# Altium schematic sheet KA1249F51_2.SchDoc
size 297 x 209 mm; Developed: Хажиев А.Ф.; DocumentCode: XXX 1.000.000 Э0; DocumentNumber: XXX 1.000.000 Э3; SheetNumber: 2; SheetTotal: 1
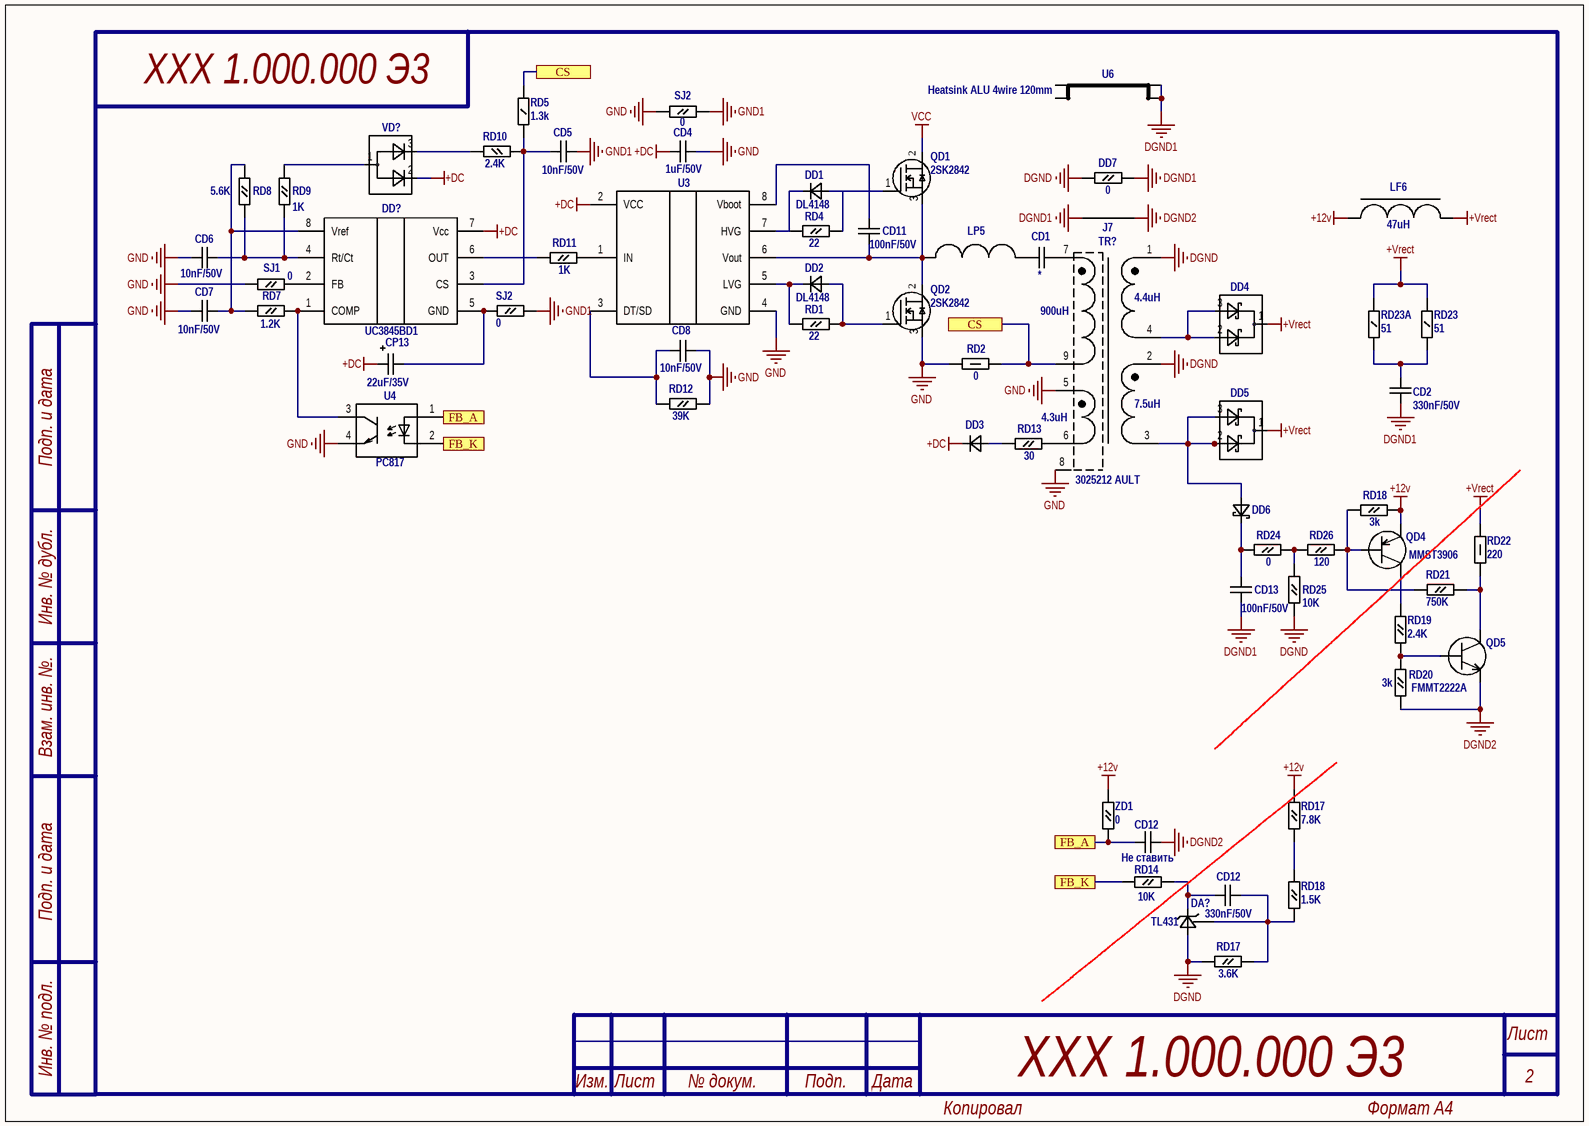
[diagram p0: KA1249F51_2.SchDoc]

## Parts
(Parts that share a designator on the sheet are numbered #1, #2 ... from top to bottom, then left to right.)
CD1  440LD22-R  [440LD22-R]  (value not drawn)
CD2  C=: 330nF/50V  [1206_C]  (hidden comment: Cap_Keram_Chip)
CD4  C=: 1uF/50V  [1206_C]  (hidden comment: Cap_Keram_Chip)
CD5  C=: 10nF/50V  [1206_C]  (hidden comment: Cap_Keram_Chip)
CD6  C=: 10nF/50V  [1206_C]  (hidden comment: Cap_Keram_Chip)
CD7  C=: 10nF/50V  [1206_C]  (hidden comment: Cap_Keram_Chip)
CD8  C=: 10nF/50V  [1206_C]  (hidden comment: Cap_Keram_Chip)
CD11  C=: 100nF/50V  [1206_C]  (hidden comment: Cap_Keram_Chip)
CD12#1  C=: Не ставить  [1206_C]  (hidden comment: Cap_Keram_Chip)
CD12#2  C=: 330nF/50V  [1206_C]  (hidden comment: Cap_Keram_Chip)
CD13  C=: 100nF/50V  [1206_C]  (hidden comment: Cap_Keram_Chip)
CP13  value 22uF/35V  [Cap_electrolit]  (hidden comment: Cap_Electrolit_Lead)
DA?  TL431  [SO-8]
DD1  DL4148  [FR207]
DD2  DL4148  [FR207]
DD3  Diode 2pin  [SOD80]  (value not drawn)
DD4  Diode shottky 3pin K-K  [TO-263AB]  (value not drawn)
DD5  Diode shottky 3pin K-K  [TO-263AB]  (value not drawn)
DD6  Diode shotky  [DO-204]  (value not drawn)
DD7  value 0  [0.125W]  (hidden comment: 1/8W)
DD?  UC3845BD1
J7  (no value)
LF6  value 47uH  [RCH664]  (hidden comment: 5208)
LP5  BL01RN1A1D2B  [BL01RN1A1D2B]  (value not drawn)
QD1  2SK2842  [TO-220AB]
QD2  2SK2842  [TO-220AB]
QD4  MMST3906  [SOT23_BEC]
QD5  FMMT2222A  [SOT23_N]
RD1  value 22  [0.125W]  (hidden comment: 1/8W)
RD2  value 0  [0.5W]  (hidden comment: 1/2W)
RD4  value 22  [0.125W]  (hidden comment: 1/8W)
RD5  value 1.3k  [1206 (3216)R]  (hidden comment: 1206)
RD7  value 1.2K  [0.125W]  (hidden comment: 1/8W)
RD8  value 5.6K  [0.125W]  (hidden comment: 1/8W)
RD9  value 1K  [0.125W]  (hidden comment: 1/8W)
RD10  value 2.4K  [0.125W]  (hidden comment: 1/8W)
RD11  value 1K  [0.125W]  (hidden comment: 1/8W)
RD12  value 39K  [0.125W]  (hidden comment: 1/8W)
RD13  value 30  [0.125W]  (hidden comment: 1/8W)
RD14  value 10K  [0.125W]  (hidden comment: 1/8W)
RD17#1  value 7.8K  [0.125W]  (hidden comment: 1/8W)
RD17#2  value 3.6K  [0.125W]  (hidden comment: 1/8W)
RD18#1  value 3k  [0.125W]  (hidden comment: 1/8W)
RD18#2  value 1.5K  [0.125W]  (hidden comment: 1/8W)
RD19  value 2.4K  [0.125W]  (hidden comment: 1/8W)
RD20  value 3k  [0.125W]  (hidden comment: 1/8W)
RD21  value 750K  [0.125W]  (hidden comment: 1/8W)
RD22  value 220  [0.5W]  (hidden comment: 1/2W)
RD23  value 51  [1206 (3216)R]  (hidden comment: 1206)
RD23A  value 51  [1206 (3216)R]  (hidden comment: 1206)
RD24  value 0  [0.125W]  (hidden comment: 1/8W)
RD25  value 10K  [0.125W]  (hidden comment: 1/8W)
RD26  value 120  [0.125W]  (hidden comment: 1/8W)
SJ1  value 0  [0.125W]  (hidden comment: 1/8W)
SJ2#1  value 0  [0.125W]  (hidden comment: 1/8W)
SJ2#2  value 0  [0.125W]  (hidden comment: 1/8W)
TR?  3025212 AULT  L4: 4.3uH  L1: 4.4uH  L2: 7.5uH  L3: 900uH
U3  L6384  [SO-8]  (value not drawn)
U4  PC817
U6  Heatsink ALU 4wire 120mm
VD?  Diode 3pin A-A  [TO-263AB]  (value not drawn)
ZD1  value 0  [0.125W]  (hidden comment: 1/8W)

## Ports
CS, FB_A, FB_K

## Nets
+12v: LF6.2 QD4.E RD17#1.2 RD18#1.2 ZD1.2
+DC: CD4.2 CP13.1(+) DD3.1(K) DD?.7(Vcc) U3.2(VCC) VD?.2
+Vrect: DD4.1 DD5.1 LF6.1 RD22.2 RD23.1 RD23A.1
DGND: DA?.2(A) DD7.2 RD17#2.2 RD25.2 TR?.1 TR?.2
DGND1: CD2.1 CD13.1 DD7.1 J7.2 U6.3 U6.4
DGND2: CD12#1.2 J7.1 QD5.2(E) RD20.2
GND: CD4.1 CD6.1 CD7.1 CD8.2 QD2.3(S) RD2.1 RD12.1 SJ1.1 SJ2#1.1 TR?.5 TR?.8 U3.4(GND) U4.4
GND1: CD5.1 SJ2#1.2 SJ2#2.1
VCC: QD1.2(D)
CS: RD2.2 RD5.2 TR?.9 ; port CS
FB_A: CD12#1.1 U4.1 ZD1.1 ; port FB_A
FB_K: RD14.1 U4.2 ; port FB_K
NetCD1_1: CD1.1 LP5.2
NetCD1_2: CD1.2 TR?.7
NetCD2_2: CD2.2 RD23.2 RD23A.2
NetCD5_2: CD5.2 DD?.3(CS) RD5.1 RD10.2
NetCD6_2: CD6.2 DD?.4(Rt/Ct) RD8.2 RD9.2
NetCD7_2: CD7.2 DD?.8(Vref) RD7.2 RD8.1
NetCD8_1: CD8.1 RD12.2 U3.3(DT/SD)
NetCD11_1: CD11.1 LP5.1 QD1.3(S) QD2.2(D) U3.6(Vout)
NetCD11_2: CD11.2 U3.8(Vboot)
NetCD12#2_1: CD12#2.1 DA?.3(C) RD14.2
NetCD12#2_2: CD12#2.2 DA?.1(R) RD17#2.1 RD18#2.2
NetCD13_2: CD13.2 DD6.2(K) RD24.2
NetCP13_2: CP13.2(-) DD?.5(GND) SJ2#2.2
NetDD1_1: DD1.1(K) RD4.1 U3.7(HVG)
NetDD1_2: DD1.2(A) QD1.1(G) RD4.2
NetDD2_1: DD2.1(K) RD1.1 U3.5(LVG)
NetDD2_2: DD2.2(A) QD2.1(G) RD1.2
NetDD3_2: DD3.2(A) RD13.1
NetDD4_2: DD4.2 DD4.3 TR?.4
NetDD5_2: DD5.2 DD5.3 DD6.1(A) TR?.3
NetDD?_1: DD?.1(COMP) RD7.1 U4.3
NetDD?_2: DD?.2(FB) SJ1.2
NetDD?_6: DD?.6(OUT) RD11.1
NetQD4_B: QD4.B RD18#1.1 RD21.2 RD26.2
NetQD4_C: QD4.C RD19.1
NetQD5_1: QD5.1(B) RD19.2 RD20.1
NetQD5_3: QD5.3(C) RD21.1 RD22.1
NetRD9_1: RD9.1 VD?.1
NetRD10_1: RD10.1 VD?.3
NetRD11_2: RD11.2 U3.1(IN)
NetRD13_2: RD13.2 TR?.6
NetRD17#1_1: RD17#1.1 RD18#2.1
NetRD24_1: RD24.1 RD25.1 RD26.1

Not connected (* = marked no-connect by the designer): U6 1(0) 2(1)

## Notes on the sheet
- Подп. и дата
- Инв. № дубл.
- Взам. инв. №.
- Инв. № подл.
- Изм.
- Лист
- № докум.
- Подп.
- Дата
- Копировал
- Формат А4

## Library data of the parts
DA? = TL431: pin to pad: 1>8 2>2+3+6+7 3>1
DD1 DD2 = FR207
J7 = Jumper: 0: 0
LF6 = COIL RCH
QD1 QD2 = IRF840
QD4 = PNP
QD5 = BCR108: NPN General-purpose Transistor; Mark: 1P
RD5 RD23 RD23A = 1/4W
U6 = Heatsink AULT1: 0: 0
VD? = Diode 3pin A-A: CASE MARK: 1P
CD1 = 440LD22-R: VALUE: *
DD? = UC3845BD1: 0: 0
U3 = L6384: 0: 0
U4 = PC817: 0: 0